# EAGLE design USB-UART_FT230XS_single-sided (EAGLE 7.4.0)
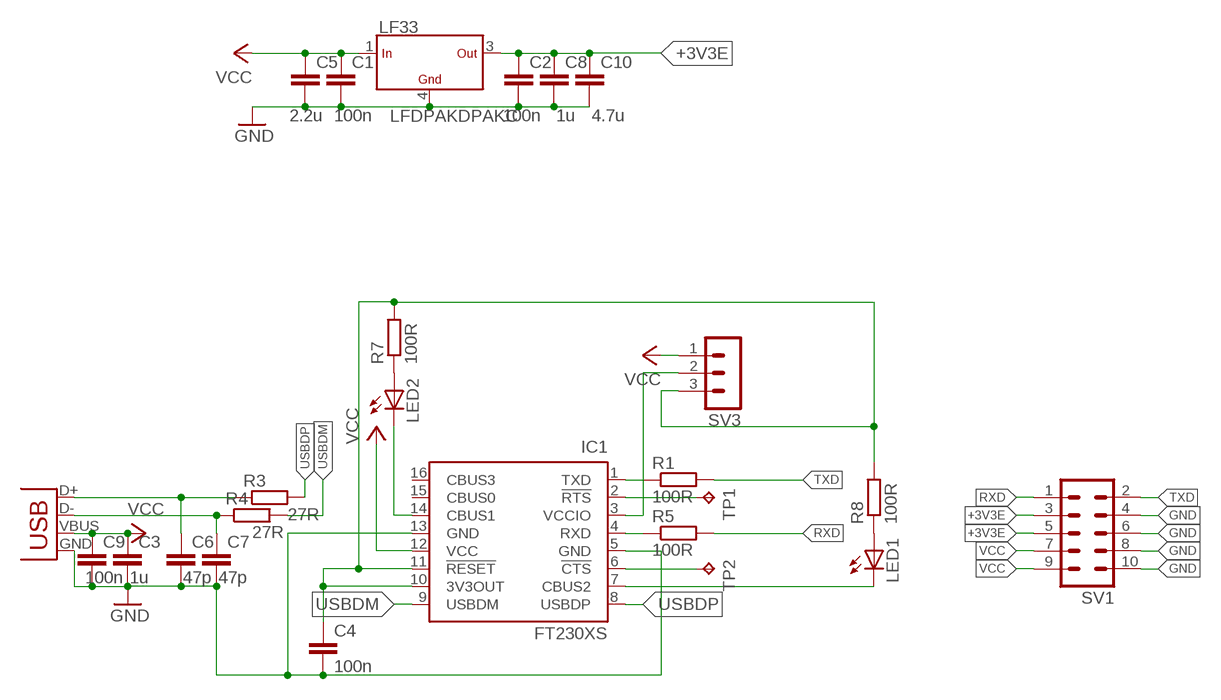
[diagram p0: schematic, sheet 1]

## Parts
C1  100n  C-EUC0805  [C0805]
C2  100n  C-EUC0805  [C0805]
C3  1u  C-EUC0805  [C0805]
C4  100n  C-EUC0805  [C0805]
C5  2.2u  C-EUC1206  [C1206]
C6  47p  C-EUC0805  [C0805]
C7  47p  C-EUC0805  [C0805]
C8  1u  C-EUC1206  [C1206]
C9  100n  C-EUC1206  [C1206]
C10  4.7u  C-EUC1206  [C1206]
IC1  FT230XS  [SSOP16]
LED1  LEDCHIP-LED0603  [CHIP-LED0603]
LED2  LEDCHIP-LED0603  [CHIP-LED0603]
LF33  LFDPAKDPAKC  [DPAK]
R1  100R  R-EU_M0805  [M0805]
R3  27R  R-EU_M0805  [M0805]
R4  27R  R-EU_M0805  [M0805]
R5  100R  R-EU_M0805  [M0805]
R7  100R  R-EU_M0805  [M0805]
R8  100R  R-EU_M0805  [M0805]
SV1  MA05-2  [MA05-2]
SV3  MA03-1  [MA03-1]
TP1  TPB1,27  [B1,27]
TP2  TPB1,27  [B1,27]
X1  USBSMD  [USB-MINIB]

## Nets
+3V3: C4.1 IC1.10(3V3OUT) IC1.11(!RESET) R7.2 R8.2 SV3.3
+3V3E: C2.1 C8.1 C10.1 LF33.3(OUT) SV1.3 SV1.5
GND: C1.2 C2.2 C3.2 C4.2 C5.2 C6.2 C7.2 C8.2 C9.2 C10.2 IC1.5(GND) IC1.13(GND) LF33.4(GND) SV1.4 SV1.6 SV1.8 SV1.10 X1.GND
N$1: C6.1 R3.1 X1.D+
N$2: C7.1 R4.1 X1.D-
N$3: IC1.1(TXD) R1.1
N$4: IC1.2(!RTS) TP1.TP
N$5: IC1.4(RXD) R5.1
N$6: LED2.A R7.1
N$7: IC1.3(VCCIO) SV3.2
N$8: LED1.A R8.1
N$9: IC1.14(CBUS1) LED2.C
N$10: IC1.7(CBUS2) LED1.C
N$11: IC1.6(!CTS) TP2.TP
RXD: R5.2 SV1.1
TXD: R1.2 SV1.2
USBDM: IC1.9(USBDM) R4.2
USBDP: IC1.8(USBDP) R3.2
VCC: C1.1 C3.1 C5.1 C9.1 IC1.12(VCC) LF33.1(IN) SV1.7 SV1.9 SV3.1 X1.VBUS
Unconnected: IC1.15(CBUS0) IC1.16(CBUS3)

## Library data of the parts
C1-C10 = rcl:C-EU: CAPACITOR, European symbol
IC1 = ftdichip:FT230X: USB to BASIC UART IC Auto generated by make-symbol-device-package-bsdl.ulp Rev. 43 Source: Data sheet <http://www.ftdichip.com/Support/Documents/DataSheets/ICs/DS_FT230X.pdf>
LED1 LED2 = led:LED: LED OSRAM: - CHIPLED LG R971, LG N971, LY N971, LG Q971, LY Q971, LO R971, LY R971 LH N974, LH R974 LS Q976, LO Q976, LY Q976 LO Q996 - Hyper CHIPLED LW Q18S LB Q993, LB Q99A, LB R99A - SideLED LS A670, LO A670, LY A670, LG A670, LP A670 LB A673, LV A673, LT A673, LW A673 LH A674 LY A675 LS A676, LA A676, LO A676, LY A676, LW A676 LS A679, LY A679, LG A679 - Hyper Micro SIDELED® LS Y876, LA Y876, LO Y876, LY Y876 LT Y87S - SmartLED LW L88C, LW L88S LB L89C, LB L89S, LG L890 LS L89K, LO L89K, LY L89K LS L896, LA L896, LO L896, LY L896 - TOPLED LS T670, LO T670, LY T670, LG T670, LP T670 LSG T670, LSP T670, LSY T670, LOP T670, LYG T670 LG T671, LOG T671, LSG T671 LB T673, LV T673, LT T673, LW T673 LH T674 LS T676, LA T676, LO T676, LY T676, LB T676, LH T676, LSB T676, LW T676 LB T67C, LV T67C, LT T67C, LS T67K, LO T67K, LY T67K, LW E67C LS E67B, LA E67B, LO E67B, LY E67B, LB E67C, LV E67C, LT E67C LW T67C LS T679, LY T679, LG T679 LS T770, LO T770, LY T770, LG T770, LP T770 LB T773, LV T773, LT T773, LW T773 LH T774 LS E675, LA E675, LY E675, LS T675 LS T776, LA T776, LO T776, LY T776, LB T776 LHGB T686 LT T68C, LB T68C - Hyper Mini TOPLED® LB M676 - Mini TOPLED Santana® LG M470 LS M47K, LO M47K, LY M47K Source: http://www.osram.convergy.de LUXEON: - LUMILED® LXK2-PW12-R00, LXK2-PW12-S00, LXK2-PW14-U00, LXK2-PW14-V00 LXK2-PM12-R00, LXK2-PM12-S00, LXK2-PM14-U00 LXK2-PE12-Q00, LXK2-PE12-R00, LXK2-PE12-S00, LXK2-PE14-T00, LXK2-PE14-U00 LXK2-PB12-K00, LXK2-PB12-L00, LXK2-PB12-M00, LXK2-PB14-N00, LXK2-PB14-P00, LXK2-PB14-Q00 LXK2-PR12-L00, LXK2-PR12-M00, LXK2-PR14-Q00, LXK2-PR14-R00 LXK2-PD12-Q00, LXK2-PD12-R00, LXK2-PD12-S00 LXK2-PH12-R00, LXK2-PH12-S00 LXK2-PL12-P00, LXK2-PL12-Q00, LXK2-PL12-R00 Source: www.luxeon.com KINGBRIGHT: KA-3528ASYC Source: www.kingbright.com
LF33 = #PaJa_30:LF??C: LF??C - stabilizátory low-drop výstup dle typu 1,25 - 12V
R1 R3-R5 R7 R8 = rcl:R-EU_: RESISTOR, European symbol
SV1 = con-lstb:MA05-2: PIN HEADER; OC_FARNELL: unknown; OC_NEWARK: unknown
SV3 = con-lstb:MA03-1: PIN HEADER; OC_FARNELL: unknown; OC_NEWARK: unknown
TP1 TP2 = testpad:TP: Test pad
X1 = SparkFun:USB: USB Connectors USB-B-PTH is fully proven SKU : PRT-00139 USB-miniB is fully proven SKU : PRT-00587 USB-A-PCB is untested. USB-A-H is throughly reviewed, but untested. Spark Fun Electronics SKU : PRT-00437 USB-B-SMT is throughly reviewed, but untested. Needs silkscreen touching up. USB-A-S has not been used/tested USB-MB-H has not been used/tested

## Board
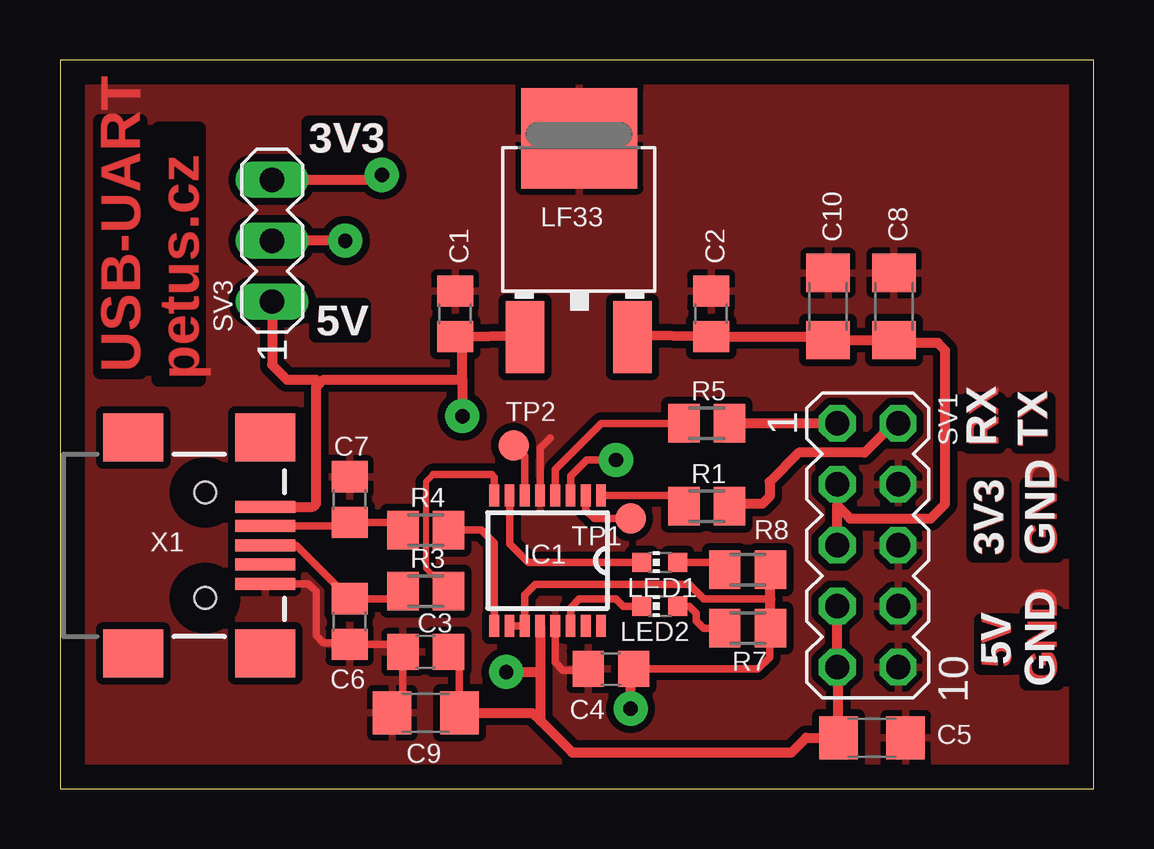
[diagram p1: board, top side]
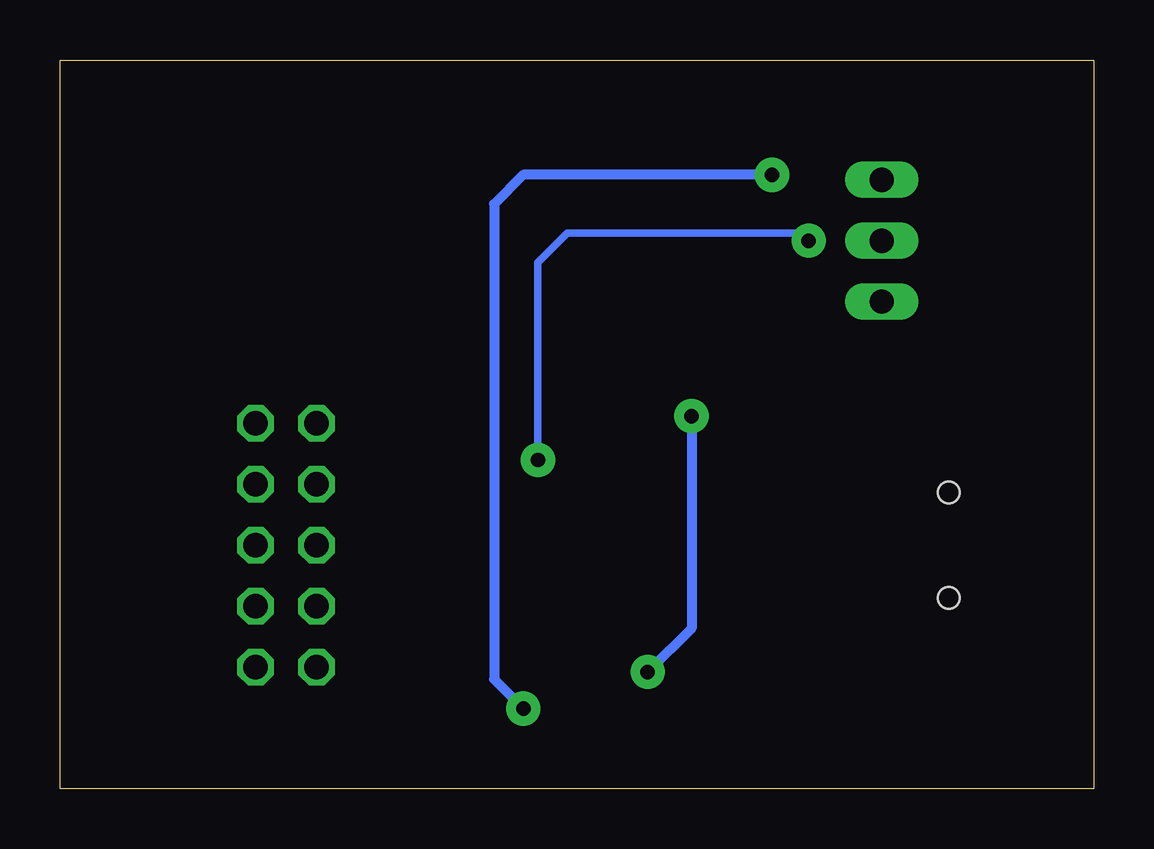
[diagram p2: board, bottom side, seen from below]

Size 43.08 x 30.39 mm. Coordinates in mm from the lower left corner, seen from the top.
Outline: 0,0 43.08,0 43.08,30.39 0,30.39 0,0
Copper layers (1*16): Top 0.035mm / dielectric 1.5mm / Bottom 0.035mm
Design rules "default": minimum track width 10mil, minimum drill 24mil, track to track 8mil, track to pad 8mil, pad to pad 8mil, via to via 8mil, smd to smd 8mil, copper to edge 40mil, drill to drill 8mil, minimum pad ring 10mil, minimum via ring 8mil, stop-mask expansion 4mil, vias tented up to drill 0mil, thermal gap 10mil

### Footprints (pad centres in the part's own frame; a part is rotated, then mirrored left to right if it is on the bottom)
C0805 = smd 1.3 x 1.5: 1 -0.95,0; 2 0.95,0
C1206 = smd 1.6 x 1.8: 1 -1.4,0; 2 1.4,0
SSOP16 = smd 0.914 x 0.406: 1 -2.718,2.223; 2 -2.718,1.587; 3 -2.718,0.953; 4 -2.718,0.318; 5 -2.718,-0.318; 6 -2.718,-0.953; 7 -2.718,-1.587; 8 -2.718,-2.223; 9 2.718,-2.223; 10 2.718,-1.587; 11 2.718,-0.953; 12 2.718,-0.318; 13 2.718,0.318; 14 2.718,0.953; 15 2.718,1.587; 16 2.718,2.223
CHIP-LED0603 = smd 0.8 x 0.8: A 0,-0.75; C 0,0.75
DPAK = smd 1.6 x 2.997: 1 -2.261,-4.928; 3 2.21,-4.928 | smd 4.826 x 4.191: 4 0,3.353
M0805 = smd 1.3 x 1.6: 1 -0.95,0; 2 0.95,0
MA05-2 = drill 1.016 octagon: 1 -5.08,-1.27; 2 -5.08,1.27; 3 -2.54,-1.27; 4 -2.54,1.27; 5 0,-1.27; 6 0,1.27; 7 2.54,-1.27; 8 2.54,1.27; 9 5.08,-1.27; 10 5.08,1.27
MA03-1 = drill 1.016 long: 1 -2.54,0; 2 0,0; 3 2.54,0
B1,27 = smd 1.27 x 1.27: TP 0,0
USB-MINIB = smd 2.5 x 0.5: D+ 2.5,0; D- 2.5,0.8; GND 2.5,-1.6; ID 2.5,-0.8; VBUS 2.5,1.6 | smd 2.5 x 2: MTN1 -3,4.5; MTN2 2.5,4.5; MTN3 -3,-4.5; MTN4 2.5,-4.5 | hole 0.9: 0,2.2; 0,-2.2

### Placement (x,y rotation side)
C1  16.46,19.81 90 top
C2  27.13,19.81 90 top
C3  15.24,5.71 180 top
C4  22.96,5 180 top
C5  33.83,2.13 0 top
C6  12.06,6.99 270 top
C7  12.06,12.06 90 top
C8  34.75,20.12 90 top
C9  15.24,3.17 180 top
C10  32,20.12 90 top
IC1  20.32,9.53 270 top
LED1  24.99,9.45 90 top
LED2  24.99,7.62 90 top
LF33  LFDPAK?C  [DPAK]  21.64,23.77 0 top
R1  26.95,11.79 0 top
R3  15.24,8.26 0 top
R4  15.24,10.79 0 top
R5  26.95,15.24 0 top
R7  28.65,6.71 0 top
R8  28.65,9.14 0 top
SV1  33.66,10.16 270 top
SV3  8.84,22.86 90 top
TP1  23.77,11.28 0 top
TP2  18.9,14.33 0 top
X1  6.05,10.16 0 top

### Tracks (layer width: path | path; a pad name or v marks a point on that pad's centre or on a via)
+3V3  (via drill 0.6 pad 1.42)
  Top 0.305: IC1.10 IC1.11 19.37,8.09 19.81,8.53 26.21,8.53 26.82,7.92 29.6,7.92 | C4.1 29.08,5 29.57,5.49 29.57,6.67 R7.2
  Top 0.406: R7.2 29.6,7.92 R8.2 | v23.77,3.35 23.77,4.87 C4.1 | SV3.3 13.21,25.4 v13.41,25.6
  Bottom 0.406: v23.77,3.35 24.99,4.57 24.99,24.38 23.77,25.6 v13.41,25.6
+3V3E
  Top 0.406: LF33.3 23.9,18.9 C2.1 31.86,18.86 C10.1 C8.1 34.87,18.59 36.58,18.59 36.88,18.29 36.88,11.89 36.27,11.28 32.92,11.28 32.38,11.81 | SV1.5 32.38,11.81 | SV1.3 32.38,11.81
GND
  Top 0.305: IC1.13 20.64,5.27 20.95,4.96 21.96,4.96 C4.2 | X1.GND 10.34,8.56 10.67,8.23 10.67,6.4 10.97,6.1 12,6.1 C6.2 13.97,6.04 C3.2 14.29,3.62 C9.2 | IC1.5 20,14.21 20.42,14.63
  pour Top (isolate 0.305): 0,30.4 43.1,30.4 43.1,0 0,0
N$1
  Top 0.305: R3.1 13.97,7.93 C6.1 9.84,10.16 X1.D+
N$2
  Top 0.305: X1.D- 11.91,10.96 C7.1 13.97,11.12 R4.1
N$3
  Top 0.305: IC1.1 25.54,12.24 R1.1
N$4
  Top 0.305: IC1.2 21.91,11.62 22.25,11.28 TP1.TP
N$5
  Top 0.305: R5.1 22.55,15.24 20.64,13.32 IC1.4
N$6
  Top 0.305: LED2.A 26.21,7.62 26.52,7.32 26.52,7.01 26.82,6.71 R7.1
N$7  (via drill 0.6 pad 1.42)
  Top 0.305: IC1.3 21.27,13.04 21.95,13.72 v23.16,13.72
  Top 0.406: v11.89,22.86 SV3.2
  Bottom 0.305: v23.16,13.72 23.16,21.95 21.95,23.16 12.19,23.16 v11.89,22.86
N$8
  Top 0.305: LED1.A 27.4,9.45 R8.1
N$9
  Top 0.305: IC1.14 21.27,7.56 21.64,7.92 23.16,7.92 23.47,7.62 LED2.C
N$10
  Top 0.305: IC1.7 18.73,10.22 19.51,9.45 LED1.C
N$11
  Top 0.305: IC1.6 19.37,13.88 TP2.TP
RXD
  Top 0.406: SV1.1 R5.2
TXD
  Top 0.406: SV1.2 34.75,15.24 33.53,14.02 30.79,14.02 29.57,12.8 29.57,12.19 29.26,11.89 28,11.89 R1.2
USBDM
  Top 0.305: R4.2 17.55,10.79 18.1,10.25 IC1.9
USBDP
  Top 0.254: 15.54,13.11 15.24,12.8 15.24,9.21 R3.2
  Top 0.305: IC1.8 18.1,12.99 17.98,13.11 15.54,13.11
VCC  (via drill 0.6 pad 1.42)
  Top 0.305: C9.1 16.64,5.26 C3.1
  Top 0.406: LF33.1 19.33,18.9 C1.1 16.76,18.86 16.76,17.07 | SV1.7 SV1.9 32.43,4.82 C5.1 31.09,2.13 30.48,1.52 21.34,1.52 20,2.86 | IC1.12 20,4.88 | 20,4.88 20,2.86 | C9.1 19.68,3.17 20,2.86 | X1.VBUS 10.54,11.76 10.67,11.89 10.67,16.76 10.82,16.92 | 10.82,16.92 10.97,17.07 16.76,17.07 | 16.76,17.07 v16.76,15.54 | v18.59,4.88 20,4.88 | 10.82,16.92 10.67,17.07 9.45,17.07 8.84,17.68 SV3.1
  Bottom 0.406: v16.76,15.54 16.76,6.71 v18.59,4.88

### Text on the board
Top: 3V3 | 5V | USB-UART | petus.cz | RX | TX | 3V3 | GND | 5V | GND
tNames: 3V3 | 5V | RX | TX | 3V3 | GND | 5V | GND